# EAGLE design acoustic_1_0 (EAGLE 6.5.0)
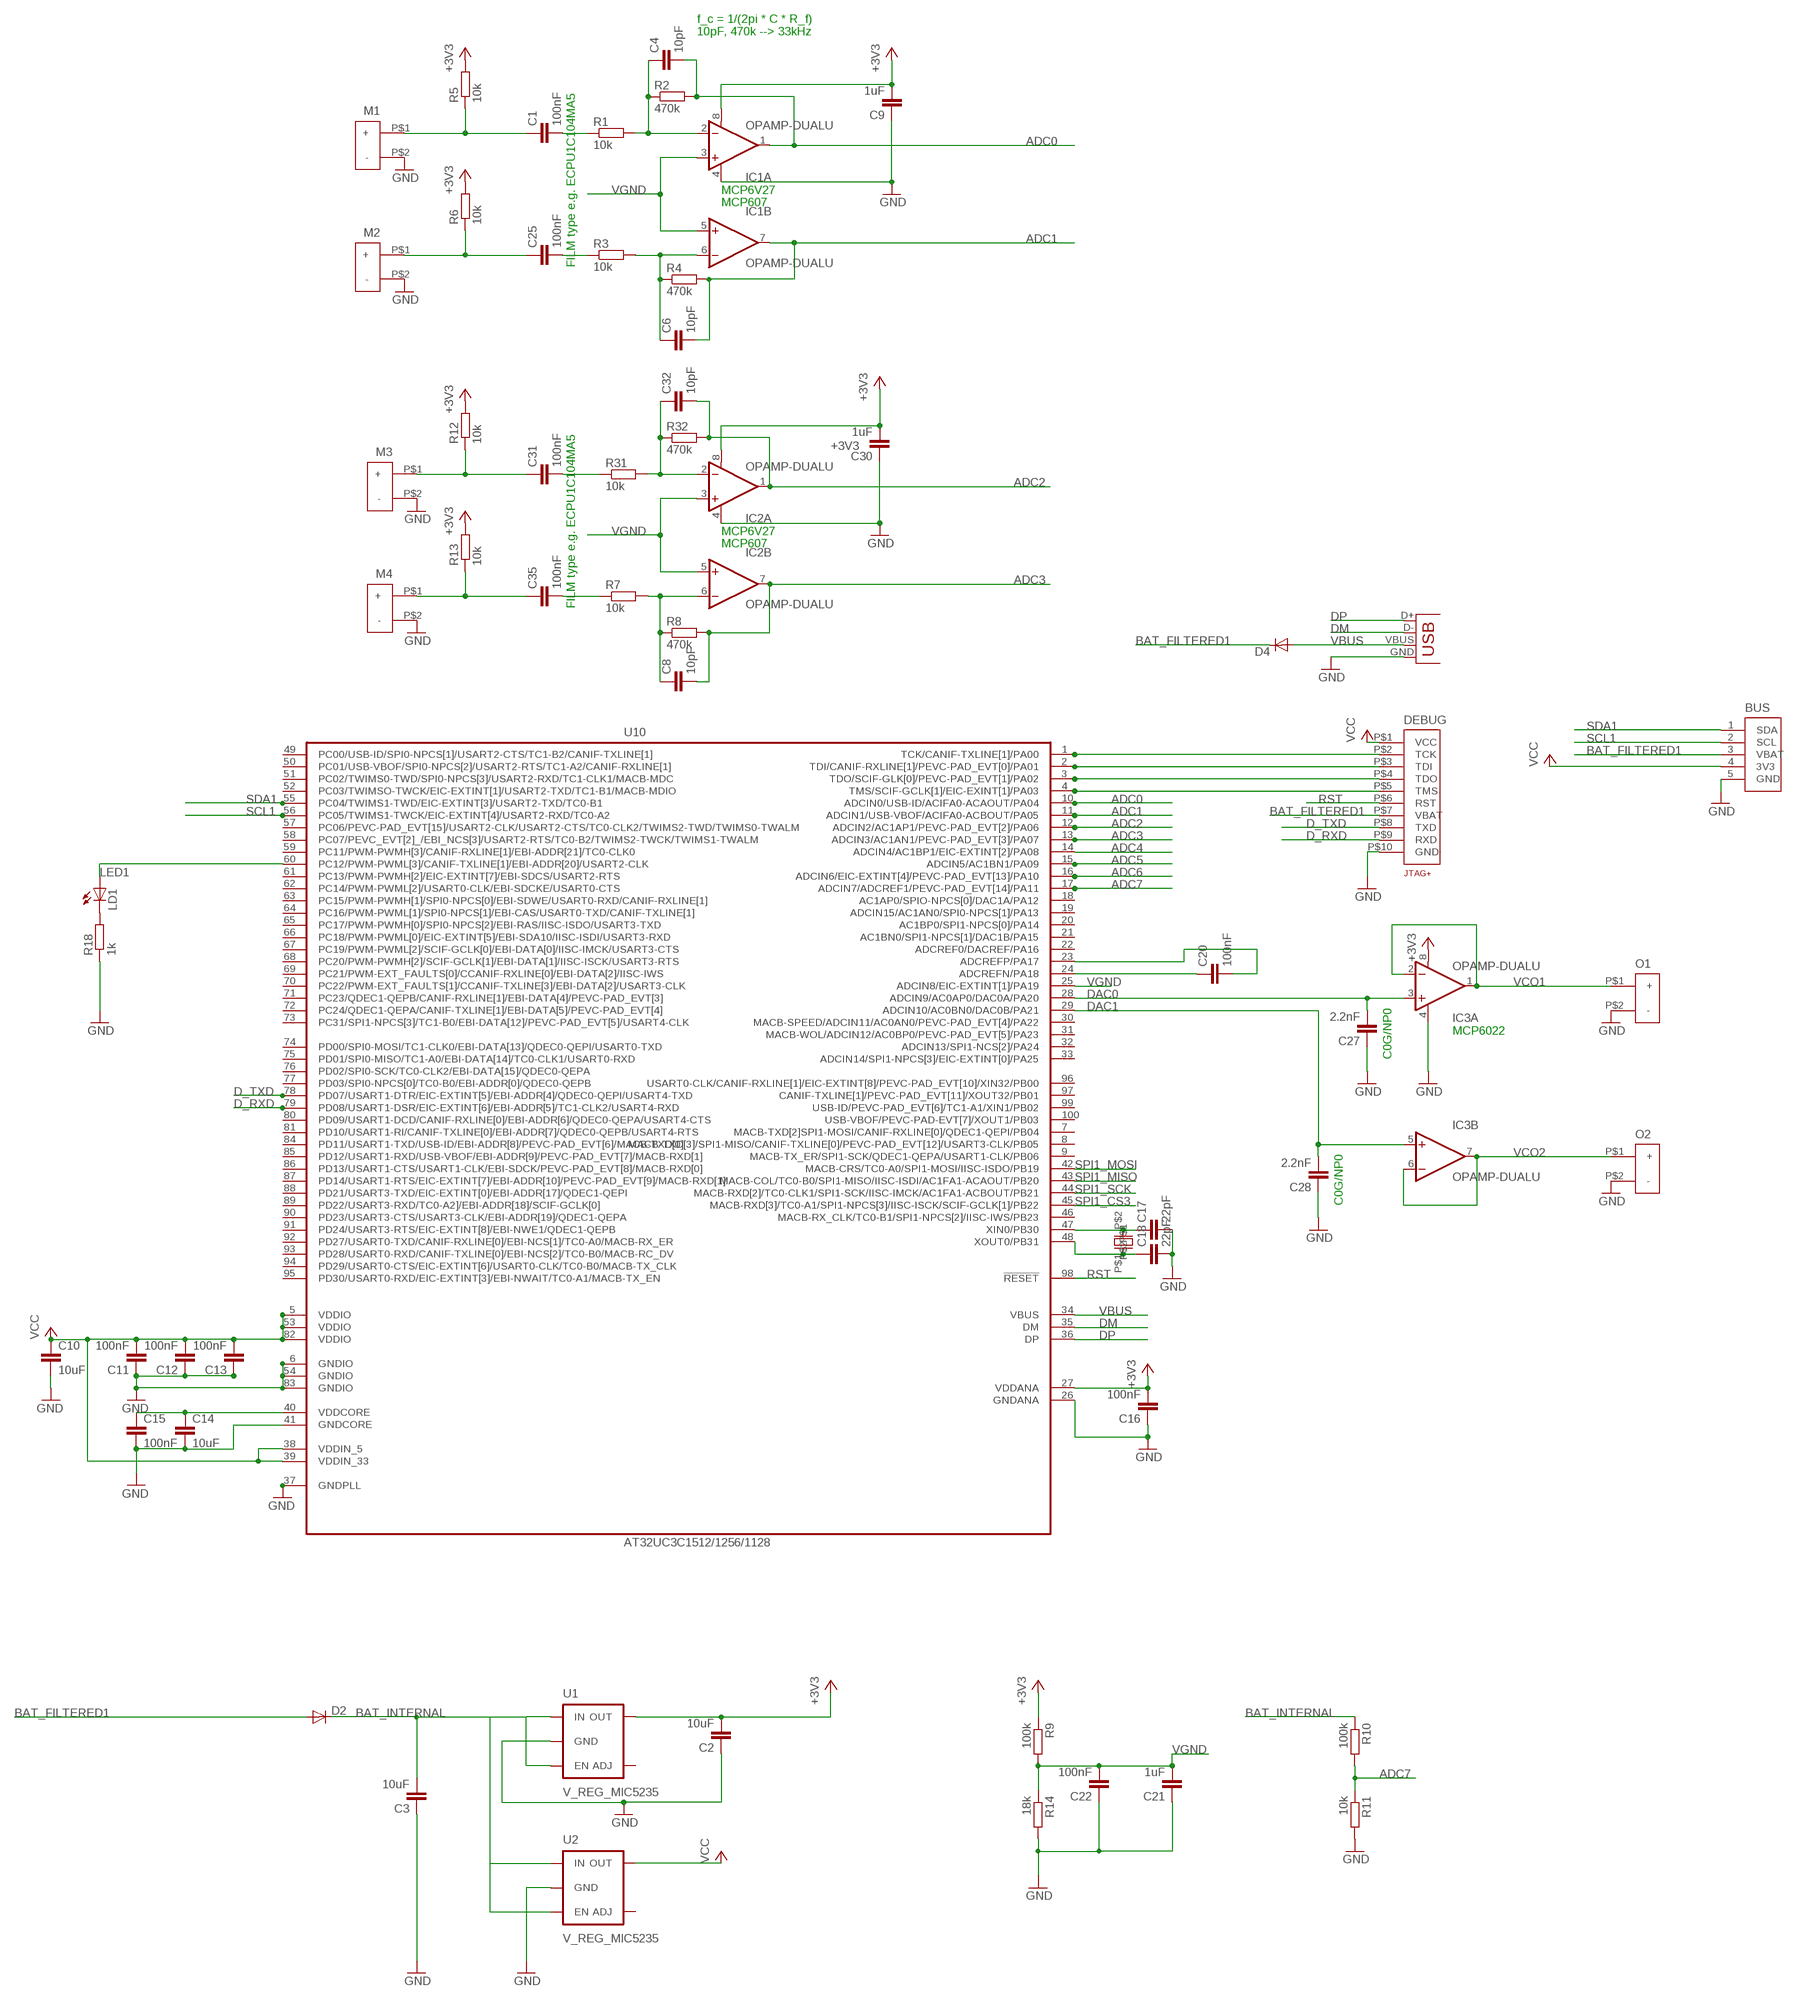
[diagram p0: schematic, sheet 1]

## Parts
BUS  I2C_BUS_PICOVERTICAL  [MOLEX_CONNECTOR_5_PINS_VERTICAL]
C1  100nF  C-EUC0805  [C0805]
C2  10uF  C-EUC0805  [C0805]
C3  10uF  C-EUC0805  [C0805]
C4  10pF  C-EUC0603  [C0603]
C6  10pF  C-EUC0603  [C0603]
C8  10pF  C-EUC0603  [C0603]
C9  1uF  C-EUC0805  [C0805]
C10  10uF  C-EUC0805  [C0805]
C11  100nF  C-EUC0603  [C0603]
C12  100nF  C-EUC0603  [C0603]
C13  100nF  C-EUC0603  [C0603]
C14  10uF  C-EUC0805  [C0805]
C15  100nF  C-EUC0603  [C0603]
C16  100nF  C-EUC0603  [C0603]
C17  22pF  C-EUC0402  [C0402]
C18  22pF  C-EUC0402  [C0402]
C20  100nF  C-EUC0603  [C0603]
C21  1uF  C-EUC0805  [C0805]
C22  100nF  C-EUC0603  [C0603]
C25  100nF  C-EUC0805  [C0805]
C27  2.2nF  C-EUC0805  [C0805]
C28  2.2nF  C-EUC0805  [C0805]
C30  1uF  C-EUC0805  [C0805]
C31  100nF  C-EUC0805  [C0805]
C32  10pF  C-EUC0603  [C0603]
C35  100nF  C-EUC0805  [C0805]
D2  DIODESOD  [SOD-323]
D4  DIODESOD  [SOD-323]
DEBUG  AVR32_JTAG+SERIALHIROSE_DF13  [MOLEX_CONNECTOR_10PINS]
IC1  OPAMP-DUALU  [SO08]
IC2  OPAMP-DUALU  [SO08]
IC3  OPAMP-DUALU  [SO08]
LD1  LEDCHIPLED_0805  [CHIPLED_0805]
M1  POWER  [POWER]
M2  POWER  [POWER]
M3  POWER  [POWER]
M4  POWER  [POWER]
O1  POWER  [POWER]
O2  POWER  [POWER]
R1  10k  R-EU_R0603  [R0603]
R2  470k  R-EU_R0603  [R0603]
R3  10k  R-EU_R0603  [R0603]
R4  470k  R-EU_R0603  [R0603]
R5  10k  R-EU_R0603  [R0603]
R6  10k  R-EU_R0603  [R0603]
R7  10k  R-EU_R0603  [R0603]
R8  470k  R-EU_R0603  [R0603]
R9  100k  R-EU_R0603  [R0603]
R10  100k  R-EU_R0603  [R0603]
R11  10k  R-EU_R0603  [R0603]
R12  10k  R-EU_R0603  [R0603]
R13  10k  R-EU_R0603  [R0603]
R14  18k  R-EU_R0603  [R0603]
R18  1k  R-EU_R0603  [R0603]
R31  10k  R-EU_R0603  [R0603]
R32  470k  R-EU_R0603  [R0603]
U1  V_REG_MIC5235  [SOT23-5]
U2  V_REG_MIC5235  [SOT23-5]
U10  AT32UC3C1512/1256/1128  [TQFP100]
U$8  CRYSTAL  [SMD_CRYSTAL_ABM]
X1  USB-MICROB  [USB-MICROB]

## Nets
+3V3 [power]: C2.2 C9.2 C16.2 C30.2 IC1.8(A:V+) IC2.8(A:V+) IC3.8(A:V+) R5.2 R6.2 R9.1 R12.2 R13.2 U1.5(OUT) U10.27(VDDANA)
ADC0: C4.2 IC1.1(A:OUT) R2.2 U10.10(ADCIN0/USB-ID/ACIFA0-ACAOUT/PA04)
ADC1: C6.2 IC1.7(B:OUT) R4.2 U10.11(ADCIN1/USB-VBOF/ACIFA0-ACBOUT/PA05)
ADC2: C32.2 IC2.1(A:OUT) R32.2 U10.12(ADCIN2/AC1AP1/PEVC-PAD_EVT[2]/PA06)
ADC3: C8.2 IC2.7(B:OUT) R8.2 U10.13(ADCIN3/AC1AN1/PEVC-PAD_EVT[3]/PA07)
ADC4: U10.14(ADCIN4/AC1BP1/EIC-EXTINT[2]/PA08)
ADC5: U10.15(ADCIN5/AC1BN1/PA09)
ADC6: U10.16(ADCIN6/EIC-EXTINT[4]/PEVC-PAD_EVT[13]/PA10)
ADC7: R10.2 R11.1 U10.17(ADCIN7/ADCREF1/PEVC-PAD_EVT[14]/PA11)
BAT_FILTERED1 [power]: BUS.3(VBAT) D2.2(A) D4.1(C) DEBUG.P$7(VBAT)
BAT_INTERNAL [power]: C3.2 D2.1(C) R10.1 U1.1(IN) U1.3(EN) U2.1(IN) U2.3(EN)
D_RXD: DEBUG.P$9(RXD) U10.79(PD08/USART1-DSR/EIC-EXTINT[6]/EBI-ADDR[5]/TC1-CLK2/USART4-RXD)
D_TXD: DEBUG.P$8(TXD) U10.78(PD07/USART1-DTR/EIC-EXTINT[5]/EBI-ADDR[4]/QDEC0-QEPI/USART4-TXD)
DAC0: C27.2 IC3.3(A:+IN) U10.28(ADCIN9/AC0AP0/DAC0A/PA20)
DAC1: C28.2 IC3.5(B:+IN) U10.29(ADCIN10/AC0BN0/DAC0B/PA21)
DM: U10.35(DM) X1.D-
DP: U10.36(DP) X1.D+
GND [power]: BUS.5(GND) C2.1 C3.1 C9.1 C10.2 C11.1 C12.1 C13.1 C14.2 C15.2 C16.1 C17.2 C18.2 C21.1 C22.1 C27.1 C28.1 C30.1 DEBUG.P$10(GND) IC1.4(A:V-) IC2.4(A:V-) IC3.4(A:V-) M1.P$2(-) M2.P$2(-) M3.P$2(-) M4.P$2(-) O1.P$2(-) O2.P$2(-) R11.2 R14.2 R18.1 U1.2(GND) U2.2(GND) U10.6(GNDIO) U10.26(GNDANA) U10.37(GNDPLL) U10.41(GNDCORE) U10.54(GNDIO) U10.83(GNDIO) X1.GND
LED1: LD1.A U10.60(PC12/PWM-PWML[3]/CANIF-TXLINE[1]/EBI-ADDR[20]/USART2-CLK)
N$1: DEBUG.P$5(TMS) U10.4(TMS/SCIF-GCLK[1]/EIC-EXINT[1]/PA03)
N$2: DEBUG.P$4(TDO) U10.3(TDO/SCIF-GLK[0]/PEVC-PAD_EVT[1]/PA02)
N$3: C18.1 U10.48(XOUT0/PB31) U$8.P$1
N$4: C17.1 U10.47(XIN0/PB30) U$8.P$2
N$5: LD1.C R18.2
N$6: C25.2 R3.1
N$7: C4.1 IC1.2(A:-IN) R1.2 R2.1
N$8: C20.2 U10.23(ADCREFP/PA17)
N$9: C6.1 IC1.6(B:-IN) R3.2 R4.1
N$10: C35.2 R7.1
N$11: C1.2 R1.1
N$12: C1.1 M1.P$1(+) R5.1
N$13: C25.1 M2.P$1(+) R6.1
N$14: C31.2 R31.1
N$17: DEBUG.P$3(TDI) U10.2(TDI/CANIF-RXLINE[1]/PEVC-PAD_EVT[0]/PA01)
N$19: C14.1 C15.1 U10.40(VDDCORE)
N$20: C32.1 IC2.2(A:-IN) R31.2 R32.1
N$21: C31.1 M3.P$1(+) R12.1
N$24: C35.1 M4.P$1(+) R13.1
N$26: C8.1 IC2.6(B:-IN) R7.2 R8.1
N$29: DEBUG.P$2(TCK) U10.1(TCK/CANIF-TXLINE[1]/PA00)
N$31: C20.1 U10.24(ADCREFN/PA18)
RST: DEBUG.P$6(RST) U10.98(!RESET)
SCL1: BUS.2(SCL) U10.56(PC05/TWIMS1-TWCK/EIC-EXTINT[4]/USART2-RXD/TC0-A2)
SDA1: BUS.1(SDA) U10.55(PC04/TWIMS1-TWD/EIC-EXTINT[3]/USART2-TXD/TC0-B1)
SPI1_CS3: U10.45(MACB-RXD[3]/TC0-A1/SPI1-NPCS[3]/IISC-ISCK/SCIF-GCLK[1]/PB22)
SPI1_MISO: U10.43(MACB-COL/TC0-B0/SPI1-MISO/IISC-ISDI/AC1FA1-ACAOUT/PB20)
SPI1_MOSI: U10.42(MACB-CRS/TC0-A0/SPI1-MOSI/IISC-ISDO/PB19)
SPI1_SCK: U10.44(MACB-RXD[2]/TC0-CLK1/SPI1-SCK/IISC-IMCK/AC1FA1-ACBOUT/PB21)
VBUS: D4.2(A) U10.34(VBUS) X1.VBUS
VCC [power]: BUS.4(3V3) C10.1 C11.2 C12.2 C13.2 DEBUG.P$1(VCC) U2.5(OUT) U10.5(VDDIO) U10.38(VDDIN_5) U10.39(VDDIN_33) U10.53(VDDIO) U10.82(VDDIO)
VCO1: IC3.1(A:OUT) IC3.2(A:-IN) O1.P$1(+)
VCO2: IC3.6(B:-IN) IC3.7(B:OUT) O2.P$1(+)
VGND: C21.2 C22.2 IC1.3(A:+IN) IC1.5(B:+IN) IC2.3(A:+IN) IC2.5(B:+IN) R9.2 R14.1 U10.25(ADCIN8/EIC-EXTINT[1]/PA19)
Unconnected: U1.4(ADJ) U2.4(ADJ) U10.7(MACB-TXD[2]SPI1-MOSI/CANIF-RXLINE[0]/QDEC1-QEPI/PB04) U10.8(MACB-TXD[3]/SPI1-MISO/CANIF-TXLINE[0]/PEVC-PAD_EVT[12]/USART3-CLK/PB05) U10.9(MACB-TX_ER/SPI1-SCK/QDEC1-QEPA/USART1-CLK/PB06) U10.18(AC1AP0/SPIO-NPCS[0]/DAC1A/PA12) U10.19(ADCIN15/AC1AN0/SPI0-NPCS[1]/PA13) U10.20(AC1BP0/SPI1-NPCS[0]/PA14) U10.21(AC1BN0/SPI1-NPCS[1]/DAC1B/PA15) U10.22(ADCREF0/DACREF/PA16) U10.30(MACB-SPEED/ADCIN11/AC0AN0/PEVC-PAD_EVT[4]/PA22) U10.31(MACB-WOL/ADCIN12/AC0BP0/PEVC-PAD_EVT[5]/PA23) U10.32(ADCIN13/SPI1-NCS[2]/PA24) U10.33(ADCIN14/SPI1-NPCS[3]/EIC-EXTINT[0]/PA25) U10.46(MACB-RX_CLK/TC0-B1/SPI1-NPCS[2]/IISC-IWS/PB23) U10.49(PC00/USB-ID/SPI0-NPCS[1]/USART2-CTS/TC1-B2/CANIF-TXLINE[1]) U10.50(PC01/USB-VBOF/SPI0-NPCS[2]/USART2-RTS/TC1-A2/CANIF-RXLINE[1]) U10.51(PC02/TWIMS0-TWD/SPI0-NPCS[3]/USART2-RXD/TC1-CLK1/MACB-MDC) U10.52(PC03/TWIMSO-TWCK/EIC-EXTINT[1]/USART2-TXD/TC1-B1/MACB-MDIO) U10.57(PC06/PEVC-PAD_EVT[15]/USART2-CLK/USART2-CTS/TC0-CLK2/TWIMS2-TWD/TWIMS0-TWALM) U10.58(PC07/PEVC_EVT[2]_/EBI_NCS[3]/USART2-RTS/TC0-B2/TWIMS2-TWCK/TWIMS1-TWALM) U10.59(PC11/PWM-PWMH[3]/CANIF-RXLINE[1]/EBI-ADDR[21]/TC0-CLK0) U10.61(PC13/PWM-PWMH[2]/EIC-EXTINT[7]/EBI-SDCS/USART2-RTS) U10.62(PC14/PWM-PWML[2]/USART0-CLK/EBI-SDCKE/USART0-CTS) U10.63(PC15/PWM-PWMH[1]/SPI0-NPCS[0]/EBI-SDWE/USART0-RXD/CANIF-RXLINE[1]) U10.64(PC16/PWM-PWML[1]/SPI0-NPCS[1]/EBI-CAS/USART0-TXD/CANIF-TXLINE[1]) U10.65(PC17/PWM-PWMH[0]/SPI0-NPCS[2]/EBI-RAS/IISC-ISDO/USART3-TXD) U10.66(PC18/PWM-PWML[0]/EIC-EXTINT[5]/EBI-SDA10/IISC-ISDI/USART3-RXD) U10.67(PC19/PWM-PWML[2]/SCIF-GCLK[0]/EBI-DATA[0]/IISC-IMCK/USART3-CTS) U10.68(PC20/PWM-PWMH[2]/SCIF-GCLK[1]/EBI-DATA[1]/IISC-ISCK/USART3-RTS) U10.69(PC21/PWM-EXT_FAULTS[0]/CCANIF-RXLINE[0]/EBI-DATA[2]/IISC-IWS) U10.70(PC22/PWM-EXT_FAULTS[1]/CCANIF-TXLINE[3]/EBI-DATA[2]/USART3-CLK) U10.71(PC23/QDEC1-QEPB/CANIF-RXLINE[1]/EBI-DATA[4]/PEVC-PAD_EVT[3]) U10.72(PC24/QDEC1-QEPA/CANIF-TXLINE[1]/EBI-DATA[5]/PEVC-PAD_EVT[4]) U10.73(PC31/SPI1-NPCS[3]/TC1-B0/EBI-DATA[12]/PEVC-PAD_EVT[5]/USART4-CLK) U10.74(PD00/SPI0-MOSI/TC1-CLK0/EBI-DATA[13]/QDEC0-QEPI/USART0-TXD) U10.75(PD01/SPI0-MISO/TC1-A0/EBI-DATA[14]/TC0-CLK1/USART0-RXD) U10.76(PD02/SPI0-SCK/TC0-CLK2/EBI-DATA[15]/QDEC0-QEPA) U10.77(PD03/SPI0-NPCS[0]/TC0-B0/EBI-ADDR[0]/QDEC0-QEPB) U10.80(PD09/USART1-DCD/CANIF-RXLINE[0]/EBI-ADDR[6]/QDEC0-QEPA/USART4-CTS) U10.81(PD10/USART1-RI/CANIF-TXLINE[0]/EBI-ADDR[7]/QDEC0-QEPB/USART4-RTS) U10.84(PD11/USART1-TXD/USB-ID/EBI-ADDR[8]/PEVC-PAD_EVT[6]/MACB-TXD[0]) U10.85(PD12/USART1-RXD/USB-VBOF/EBI-ADDR[9]/PEVC-PAD_EVT[7]/MACB-RXD[1]) U10.86(PD13/USART1-CTS/USART1-CLK/EBI-SDCK/PEVC-PAD_EVT[8]/MACB-RXD[0]) U10.87(PD14/USART1-RTS/EIC-EXTINT[7]/EBI-ADDR[10]/PEVC-PAD_EVT[9]/MACB-RXD[1]) U10.88(PD21/USART3-TXD/EIC-EXTINT[0]/EBI-ADDR[17]/QDEC1-QEPI) U10.89(PD22/USART3-RXD/TC0-A2]/EBI-ADDR[18]/SCIF-GCLK[0]) U10.90(PD23/USART3-CTS/USART3-CLK/EBI-ADDR[19]/QDEC1-QEPA) U10.91(PD24/USART3-RTS/EIC-EXTINT[8]/EBI-NWE1/QDEC1-QEPB) U10.92(PD27/USART0-TXD/CANIF-RXLINE[0]/EBI-NCS[1]/TC0-A0/MACB-RX_ER) U10.93(PD28/USART0-RXD/CANIF-TXLINE[0]/EBI-NCS[2]/TC0-B0/MACB-RC_DV) U10.94(PD29/USART0-CTS/EIC-EXTINT[6]/USART0-CLK/TC0-B0/MACB-TX_CLK) U10.95(PD30/USART0-RXD/EIC-EXTINT[3]/EBI-NWAIT/TC0-A1/MACB-TX_EN) U10.96(USART0-CLK/CANIF-RXLINE[1]/EIC-EXTINT[8]/PEVC-PAD_EVT[10]/XIN32/PB00) U10.97(CANIF-TXLINE[1]/PEVC-PAD_EVT[11]/XOUT32/PB01) U10.99(USB-ID/PEVC-PAD_EVT[6]/TC1-A1/XIN1/PB02) U10.100(USB-VBOF/PEVC-PAD-EVT[7]/XOUT1/PB03)

## Notes on the sheet
- f_c = 1/(2pi * C * R_f)
  10pF, 470k --> 33kHz
- MCP6V27
- MCP607
- FILM type e.g. ECPU1C104MA5
- MCP6V27
- MCP607
- FILM type e.g. ECPU1C104MA5
- MCP6022
- C0G/NP0
- C0G/NP0

## Library data of the parts
BUS = con-special_purpose:I2C_BUS_PICO; PLACE_PART: YES
C1-C4 C6 C8-C18 C20-C22 C25 C27 C28 C30-C32 C35 = rcl:C-EU: CAPACITOR, European symbol
D2 D4 = SparkFun:DIODE: Diode These are standard reverse protection diodes and small signal diodes. SMA package can handle up to about 1A. SOD-323 can handle about 200mA. What the SOD-323 package when ordering, there are some mfgs out there that are 5-pin packages.
DEBUG = con-special_purpose:AVR32_JTAG+SERIAL: Unified compact debug port with JTAG, 7-12V power supply (VBAT) and serial port.; DISTRIBUTOR: Digikey; ORDER_CODE: H3375-ND; PLACE_PART: YES
IC1-IC3 = SparkFun:OPAMP-DUAL: Operational Amplifier
LD1 = led:LED: LED OSRAM: - CHIPLED LG R971, LG N971, LY N971, LG Q971, LY Q971, LO R971, LY R971 LH N974, LH R974 LS Q976, LO Q976, LY Q976 LO Q996 - Hyper CHIPLED LW Q18S LB Q993, LB Q99A, LB R99A - SideLED LS A670, LO A670, LY A670, LG A670, LP A670 LB A673, LV A673, LT A673, LW A673 LH A674 LY A675 LS A676, LA A676, LO A676, LY A676, LW A676 LS A679, LY A679, LG A679 - Hyper Micro SIDELED® LS Y876, LA Y876, LO Y876, LY Y876 LT Y87S - SmartLED LW L88C, LW L88S LB L89C, LB L89S, LG L890 LS L89K, LO L89K, LY L89K LS L896, LA L896, LO L896, LY L896 - TOPLED LS T670, LO T670, LY T670, LG T670, LP T670 LSG T670, LSP T670, LSY T670, LOP T670, LYG T670 LG T671, LOG T671, LSG T671 LB T673, LV T673, LT T673, LW T673 LH T674 LS T676, LA T676, LO T676, LY T676, LB T676, LH T676, LSB T676, LW T676 LB T67C, LV T67C, LT T67C, LS T67K, LO T67K, LY T67K, LW E67C LS E67B, LA E67B, LO E67B, LY E67B, LB E67C, LV E67C, LT E67C LW T67C LS T679, LY T679, LG T679 LS T770, LO T770, LY T770, LG T770, LP T770 LB T773, LV T773, LT T773, LW T773 LH T774 LS E675, LA E675, LY E675, LS T675 LS T776, LA T776, LO T776, LY T776, LB T776 LHGB T686 LT T68C, LB T68C - Hyper Mini TOPLED® LB M676 - Mini TOPLED Santana® LG M470 LS M47K, LO M47K, LY M47K Source: http://www.osram.convergy.de LUXEON: - LUMILED® LXK2-PW12-R00, LXK2-PW12-S00, LXK2-PW14-U00, LXK2-PW14-V00 LXK2-PM12-R00, LXK2-PM12-S00, LXK2-PM14-U00 LXK2-PE12-Q00, LXK2-PE12-R00, LXK2-PE12-S00, LXK2-PE14-T00, LXK2-PE14-U00 LXK2-PB12-K00, LXK2-PB12-L00, LXK2-PB12-M00, LXK2-PB14-N00, LXK2-PB14-P00, LXK2-PB14-Q00 LXK2-PR12-L00, LXK2-PR12-M00, LXK2-PR14-Q00, LXK2-PR14-R00 LXK2-PD12-Q00, LXK2-PD12-R00, LXK2-PD12-S00 LXK2-PH12-R00, LXK2-PH12-S00 LXK2-PL12-P00, LXK2-PL12-Q00, LXK2-PL12-R00 Source: www.luxeon.com KINGBRIGHT: KA-3528ASYC Source: www.kingbright.com
M1-M4 O1 O2 = con-special_purpose:POWER; PLACE_PART: YES
R1-R14 R18 R31 R32 = rcl:R-EU_: RESISTOR, European symbol
U1 U2 = SparkFun:V_REG_MIC5235
U10 = atmel-avr32-michel:AT32UC3C1512/1256/1128: AT32UC3C1512/1256/1128; DISTRIBUTOR: Digikey; ORDER_CODE: AT32UC3C1512C-AUT-ND; PLACE_PART: YES; UNIT_PRICE: 17.65000; UNIT_PRICE_100X: 10.02880; UNIT_PRICE_10X: 17.65000; UNIT_PRICE_25X: 11.23240; UNIT_PRICE_50X: 11.23240
U$8 = Atmel_utils:CRYSTAL; DISTRIBUTOR: Digikey; ORDER_CODE: 535-9840-1-ND; PLACE_PART: YES
X1 = SparkFun:USB: USB Connectors USB-B-PTH is fully proven SKU : PRT-00139 USB-miniB is fully proven SKU : PRT-00587 USB-A-PCB is untested. USB-A-H is throughly reviewed, but untested. Spark Fun Electronics SKU : PRT-00437 USB-B-SMT is throughly reviewed, but untested. Needs silkscreen touching up. USB-A-S has not been used/tested USB-MB-H has not been used/tested

## Net classes
0 default: width 0.15 mm, drill 0.35 mm, clearance 0.15 mm
1 power: width 0.2 mm, drill 0.35 mm, clearance 0.15 mm
2 more_power: width 0.5 mm, drill 0.5 mm, clearance 0.15 mm

## Board
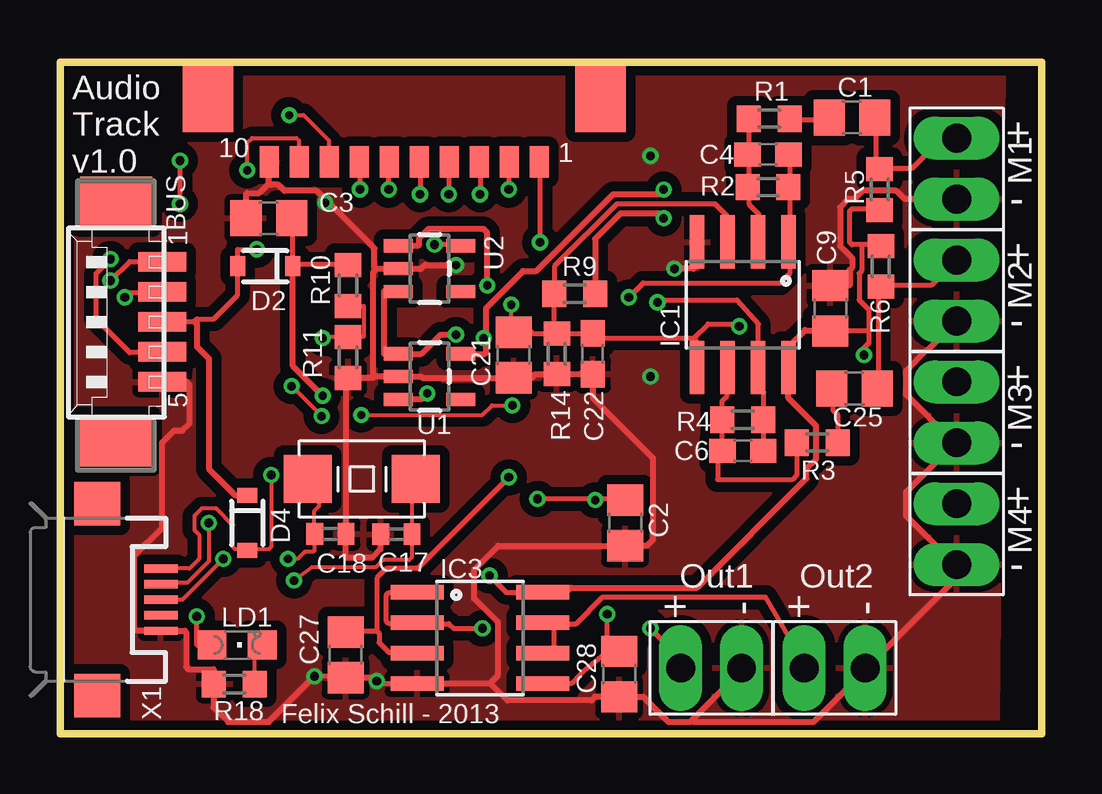
[diagram p1: board, top side]
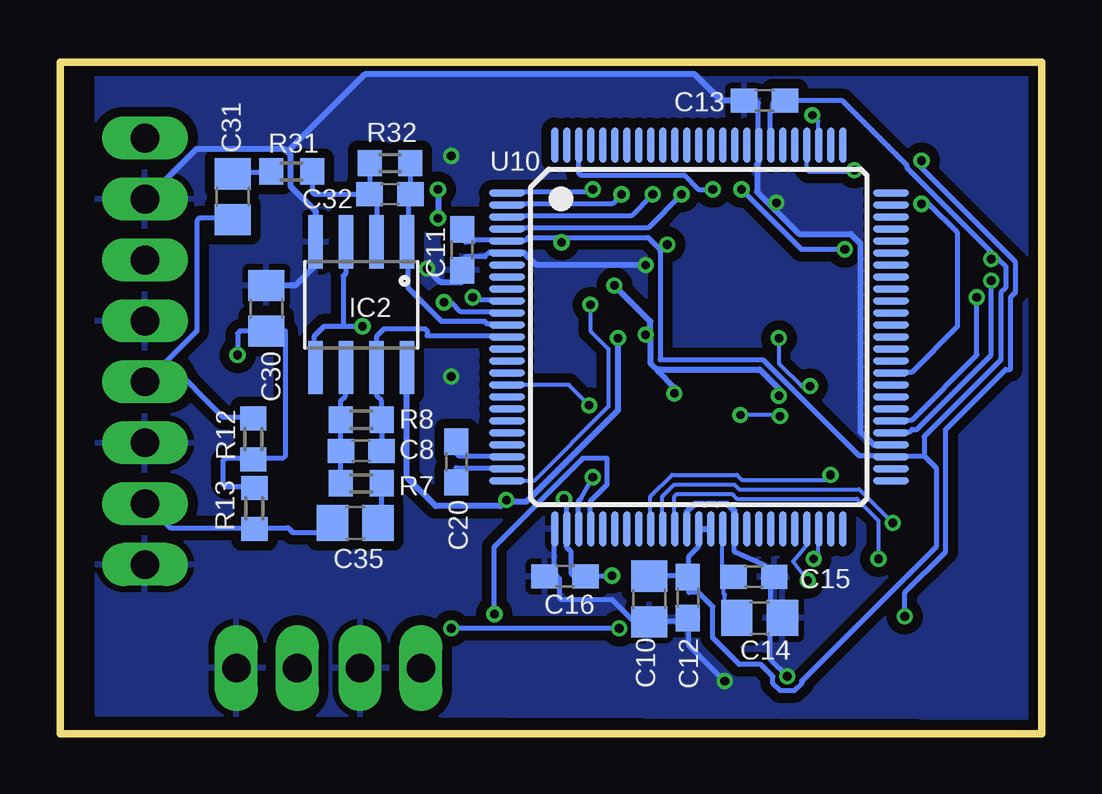
[diagram p2: board, bottom side, seen from below]

Size 40.9 x 28 mm. Coordinates in mm from the lower left corner, seen from the top.
Outline: 0,28 0,0 40.9,0 40.9,28 0,28
Copper layers (1*16): Top 0.035mm / dielectric 1mm / Bottom 0.035mm
Design rules "default": minimum track width 0.16mm, minimum drill 0.35mm, track to track 0.16mm, track to pad 0.16mm, pad to pad 0.16mm, via to via 0.16mm, smd to smd 0.15mm, copper to edge 0.2mm, drill to drill 0.2mm, minimum pad ring 0.2mm, minimum via ring 0.16mm, stop-mask expansion 4mil, vias tented up to drill 0.51mm, thermal gap 10mil

### Footprints (pad centres in the part's own frame; a part is rotated, then mirrored left to right if it is on the bottom)
MOLEX_CONNECTOR_5_PINS_VERTICAL = smd 0.8 x 2: 1 2.48,-2.57; 2 1.23,-2.57; 3 -0.02,-2.57; 4 -1.27,-2.57; 5 -2.52,-2.57 | smd 2.1 x 3: S1 4.98,-0.645; S2B -5,-0.645
C0805 = smd 1.3 x 1.5: 1 -0.95,0; 2 0.95,0
C0603 = smd 1.1 x 1: 1 -0.85,0; 2 0.85,0
C0402 = smd 0.7 x 0.9: 1 -0.65,0; 2 0.65,0
SOD-323 = smd 0.63 x 0.83: 1 -1.15,0; 2 1.15,0
MOLEX_CONNECTOR_10PINS = smd 0.8 x 1.3: P$1 -11.65,-0.65; P$2 -10.4,-0.65; P$3 -9.15,-0.65; P$4 -7.9,-0.65; P$5 -6.65,-0.65; P$6 -5.4,-0.65; P$7 -4.15,-0.65; P$8 -2.9,-0.65; P$9 -1.65,-0.65; P$10 -0.4,-0.65 | smd 2.1 x 3: P$11 -14.2,-3.4; P$12 2.15,-3.4
SO08 = smd 0.61 x 2.21: 1 -1.905,-2.616; 2 -0.635,-2.616; 3 0.635,-2.616; 4 1.905,-2.616; 5 1.905,2.616; 6 0.635,2.616; 7 -0.635,2.616; 8 -1.905,2.616
CHIPLED_0805 = smd 1.2 x 1.2: A 0,-1.05; C 0,1.05
POWER = drill 1.2 long: P$1 0,2.54; P$2 0,0
R0603 = smd 1 x 1.1: 1 -0.85,0; 2 0.85,0
SOT23-5 = smd 0.55 x 1.2: 1 -0.95,-1.3; 2 0,-1.3; 3 0.95,-1.3; 4 0.95,1.3; 5 -0.95,1.3
TQFP100 = smd 1.5 x 0.3: 1 -8,6; 2 -8,5.5; 3 -8,5; 4 -8,4.5; 5 -8,4; 6 -8,3.5; 7 -8,3; 8 -8,2.5; 9 -8,2; 10 -8,1.5; 11 -8,1; 12 -8,0.5; 13 -8,0; 14 -8,-0.5; 15 -8,-1; 16 -8,-1.5; 17 -8,-2; 18 -8,-2.5; 19 -8,-3; 20 -8,-3.5; 21 -8,-4; 22 -8,-4.5; 23 -8,-5; 24 -8,-5.5; 25 -8,-6; 51 8,-6; 52 8,-5.5; 53 8,-5; 54 8,-4.5; 55 8,-4; 56 8,-3.5; 57 8,-3; 58 8,-2.5; 59 8,-2; 60 8,-1.5; 61 8,-1; 62 8,-0.5; 63 8,0; 64 8,0.5; 65 8,1; 66 8,1.5; 67 8,2; 68 8,2.5; 69 8,3; 70 8,3.5; 71 8,4; 72 8,4.5; 73 8,5; 74 8,5.5; 75 8,6 | smd 0.3 x 1.5: 26 -6,-8; 27 -5.5,-8; 28 -5,-8; 29 -4.5,-8; 30 -4,-8; 31 -3.5,-8; 32 -3,-8; 33 -2.5,-8; 34 -2,-8; 35 -1.5,-8; 36 -1,-8; 37 -0.5,-8; 38 0,-8; 39 0.5,-8; 40 1,-8; 41 1.5,-8; 42 2,-8; 43 2.5,-8; 44 3,-8; 45 3.5,-8; 46 4,-8; 47 4.5,-8; 48 5,-8; 49 5.5,-8; 50 6,-8; 76 6,8; 77 5.5,8; 78 5,8; 79 4.5,8; 80 4,8; 81 3.5,8; 82 3,8; 83 2.5,8; 84 2,8; 85 1.5,8; 86 1,8; 87 0.5,8; 88 0,8; 89 -0.5,8; 90 -1,8; 91 -1.5,8; 92 -2,8; 93 -2.5,8; 94 -3,8; 95 -3.5,8; 96 -4,8; 97 -4.5,8; 98 -5,8; 99 -5.5,8; 100 -6,8
SMD_CRYSTAL_ABM = smd 2 x 2: P$1 -2.25,0; P$2 2.25,0
USB-MICROB = smd 0.35 x 1.4: D+ 0,2.65; D- -0.65,2.65; GND 1.3,2.65; ID 0.65,2.65; VBUS -1.3,2.65 | smd 1.8 x 1.9: MT1 -4,0; MT2 4,0

### Placement (x,y rotation side)
BUS  1.7,17.2 90 top
C1  33,25.7 180 top
C2  23.55,8.8 90 top
C3  8.7,21.5 0 top
C4  29.5,24.15 0 top
C6  28.45,11.8 0 top
C8  28.35,11.8 0 bottom
C9  32.1,17.75 270 top
C10  16.35,5.63 270 bottom
C11  24.14,20.19 90 bottom
C12  14.73,5.68 90 bottom
C13  11.55,26.4 0 bottom
C14  11.75,4.83 0 bottom
C15  11.99,6.54 0 bottom
C16  19.86,6.57 0 bottom
C17  14.01,8.33 180 top
C18  11.26,8.34 0 top
C20  24.38,11.33 90 bottom
C21  18.9,15.8 90 top
C22  22.2,15.85 90 top
C25  33.1,14.4 180 top
C27  11.9,3.3 90 top
C28  23.3,2.5 90 top
C30  32.3,17.75 270 bottom
C31  33.7,22.4 90 bottom
C32  27.15,22.5 0 bottom
C35  28.6,8.8 0 bottom
D2  8.55,19.5 180 top
D4  7.8,8.8 270 top
DEBUG  8.32,23.2 180 top
IC1  28.45,17.9 180 top
IC2  28.35,17.9 180 bottom
IC3  17.5,4 270 top
LD1  7.38,3.71 270 top
M1  37.36,22.3 0 top
M2  37.36,17.22 0 top
M3  37.36,12.14 0 top
M4  37.36,7.06 0 top
O1  28.4,2.75 90 top
O2  33.55,2.75 90 top
R1  29.55,25.65 180 top
R2  29.5,22.8 0 top
R3  31.55,12.15 180 top
R4  28.45,13.1 0 top
R5  34.15,22.7 270 top
R6  34.2,19.5 90 top
R7  28.35,10.45 180 bottom
R8  28.35,13.1 0 bottom
R9  21.45,18.35 180 top
R10  12,18.7 270 top
R11  12,15.7 270 top
R12  32.85,12.3 270 bottom
R13  32.8,9.4 90 bottom
R14  20.7,15.85 270 top
R18  7.26,2.08 0 top
R31  31.25,23.45 0 bottom
R32  27.15,23.8 0 bottom
U1  15.4,14.9 270 top
U2  15.4,19.4 270 top
U10  14.28,16.55 0 bottom
U$8  12.57,10.63 0 top
X1  1.55,5.6 270 top

### Tracks (layer width: path | path; a pad name or v marks a point on that pad's centre or on a via)
+3V3  (via drill 0.35, 0.36)
  Top 0.2: 33.4,20.4 34.2,20.4 R6.2 | 33.4,20.4 33,20.4 32.9,20.5 32.9,21.8 33,21.9 34.1,21.9 R5.2 | 33.7,16.8 33.7,17.7 33.3,18.1 33.3,19.2 33.4,19.3 33.4,20.4 | 33.7,16.8 33.7,16.3 33.4,16 33.4,15.9 v33.5,15.8 | 33.7,16.8 C9.2 | v17.9,6.6 18.6,5.9 20.1,5.9 IC3.8 | v19.9,9.8 22.3,9.8 23.5,9.8 C2.2
  Top 0.25: R9.1 22.3,20.65 23.35,21.7 24.95,21.7 v25.15,21.5 | v25.15,22.7 24.95,22.5 23.05,22.5 19.85,19.3 19.3,19.3 17.75,17.75 17.75,16.5 | 17.75,16.5 17.75,15.9 17.7,15.85 U1.5 | C9.2 31.1,16.8 31.05,16.85 30.35,16.15 30.35,15.3 IC1.8 30.35,15.2 30.35,14 31.5,12.85 31.5,11.45 31.1,11.05 31.1,10.65 26.55,6.1 21.3,6.1 21.1,5.9 20.2,5.9 IC3.8 | v22.3,9.75 22.3,9.8 | v17.65,16.5 17.75,16.5
  Bottom 0.2: R13.2 32.8,10.3 34,10.3 34.1,10.4 34.1,11.4 34,11.5 32.9,11.5 R12.2 32.8,11.5 31.6,11.5 31.5,11.6 31.5,16.8 C30.2 33.4,16.8 33.5,16.7 v33.5,15.8 | v17.9,6.6 19,6.6 C16.2 19.1,6.6 19.5,6.6 19.6,6.7 19.6,7.6 19.8,7.8 19.8,8.5 U10.27 19.8,8.6 19.8,9.7 v19.9,9.8
  Bottom 0.25: v25.15,22.7 v25.15,21.5 | IC2.8 26.45,15.25 26.45,10.7 25.25,9.5 22.55,9.5 v22.3,9.75 22.2,9.7 21.45,9.7 17.65,13.5 v17.65,16.5
ADC0  (via drill 0.36)
  Top 0.2: 30.4,22.8 30.4,24.1 C4.2 | 30.4,22.8 30.4,20.6 IC1.1 30.4,20.5 30.4,19.2 30,18.8 24.3,18.8 v23.7,18.2 | 30.4,22.8 R2.2
  Bottom 0.2: v23.7,18.2 23.6,18.1 22.3,18.1 U10.10
ADC1  (via drill 0.36)
  Top 0.2: C6.2 R4.2 29.3,14.3 29.1,14.5 29.1,15.2 IC1.7 29.1,15.3 29.1,17.1 28.2,18.1 24.9,18.1 v24.9,18
  Bottom 0.2: v24.9,18 24.6,18 24.2,17.6 22.3,17.6 U10.11
ADC2
  Bottom 0.2: U10.12 22.3,17.1 23.1,17.1 23.2,17.2 25,17.2 26.4,18.6 26.4,20.5 IC2.1 26.4,20.6 26.4,22.3 26.2,22.5 26.3,22.6 | R32.2 26.3,22.6 | 26.3,22.6 C32.2
ADC3
  Bottom 0.2: C8.2 R8.2 27.5,13.9 27.7,14.1 27.7,15.2 IC2.7 27.7,15.3 27.7,16.6 27.4,16.9 25.7,16.9 25.6,16.8 25.6,16.6 22.3,16.6 U10.13
ADC7  (via drill 0.35)
  Top 0.16: R10.2 12.65,17.85 12.65,16.55 R11.1 11,16.55 v10.95,16.5 | v18.85,13.7 18,13.7 17.6,13.3 v12.55,13.3 | v9.65,14.5 v10.9,13.25
  Bottom 0.16: U10.17 19.7,14.55 v18.85,13.7 | v12.55,13.3 10.95,13.3 v10.9,13.25 | v9.65,14.5 10,14.5 10.95,15.45 v10.95,16.5
BAT_FILTERED1  (via drill 0.36)
  Top 0.2: v12.5,22.7 12.5,23.8 DEBUG.P$7 | v8.2,20.2 7.4,20.2 D2.2 7.4,18.3 6.4,17.3 5.7,17.3 5.6,17.2 4.3,17.2 BUS.3
  Top 0.25: D4.1 7.3,9.95 6.2,11.05 6.2,15.65 5.7,16.15 5.7,17.1 5.6,17.2
  Bottom 0.2: v12.5,22.7 10,20.2 v8.2,20.2
BAT_INTERNAL  (via drill 0.35)
  Top 0.2: 9.7,19.6 12,19.6 R10.1 | 9.7,19.6 9.7,21.5 C3.2 | 9.7,19.6 D2.1
  Top 0.25: U1.3 15.05,13.95 v15.3,14.2 | v16.5,16.65 15.85,16.65 15.05,15.85 U1.1 13.5,15.85 13.5,18.45 U2.3 | U2.1 14.9,20.35 14.95,20.4 14.95,20.65 15.35,21.05 17.65,21.05 17.8,20.9 v17.8,18.7 | D2.1 9.7,15.35 v10.95,14.1
  Bottom 0.25: v15.3,14.2 15.3,14.45 15.98,15.12 | 15.98,15.12 16.3,15.45 16.3,16.45 v16.5,16.65 16.3,16.6 16.3,17.2 v17.8,18.7 | v10.95,14.1 10.95,14.4 11.75,15.2 15.9,15.2 15.98,15.12
D_RXD  (via drill 0.35)
  Top 0.16: v7.8,23.5 7.8,24.65 8,24.85 9.85,24.85 9.95,24.75 9.95,23.85 DEBUG.P$9
  Bottom 0.16: v7.8,23.5 7.85,23.45 9.7,23.45 9.8,23.55 9.8,24.55 U10.79
D_TXD  (via drill 0.35)
  Top 0.16: v9.55,25.8 10.15,25.8 11.2,24.75 11.2,23.85 DEBUG.P$8
  Bottom 0.16: v9.55,25.8 9.3,25.55 9.3,24.55 U10.78
DAC0  (via drill 0.36)
  Top 0.2: 13.2,4.3 13.3,4.2 13.3,3.8 13.7,3.4 14.8,3.4 IC3.3 | 13.2,4.3 11.9,4.3 C27.2 | 13.2,4.3 13.2,6.5 13.6,6.9 14.9,6.9 v18.7,10.7
  Bottom 0.2: v18.7,10.7 19.2,9.8 19.3,9.7 19.3,8.6 U10.28
DAC1  (via drill 0.36)
  Top 0.2: IC3.5 20.2,2.1 21.3,2.1 21.7,2.5 22.9,3.5 C28.2 22.7,3.4 22.7,3.5 22.8,3.6 v22.8,5
  Bottom 0.2: v22.8,5 22.8,7.8 19.1,11.5 18.1,11.5 18.1,10.4 18.8,9.7 18.8,8.6 U10.29
DM  (via drill 0.36)
  Top 0.16: v6.2,8.8 6.2,7.2 5.3,6.3 4.2,6.3 X1.D-
  Bottom 0.16: v6.2,8.8 7.6,10.2 12.6,10.2 12.8,10.4 15.3,10.4 15.8,9.9 15.8,8.6 U10.35
DP  (via drill 0.36)
  Top 0.16: X1.D+ 5.1,5.6 v6.8,7.3
  Bottom 0.16: v6.8,7.3 6.8,8.9 7.7,9.8 12.7,9.8 12.9,10 15.2,10 15.3,9.9 15.3,8.6 U10.36
GND  (via drill 0.35, 0.36)
  Top 0.2: v13.2,2.2 13.4,2.2 13.5,2.1 14.8,2.1 IC3.4 | v10.6,2.4 11.9,2.4 C27.1
  Top 0.25: C9.1 32.9,18.7 32.9,19.35 33,19.45 33,19.85 32.5,20.35 32.5,21.95 32.85,22.3 33.1,22.3 33.45,22.65 34.85,22.65 35.2,22.3 M1.P$2 | v25.6,19.4 26.4,19.4 26.55,19.55 26.55,20.5 IC1.4 | 8.7,22.95 8.7,23.85 DEBUG.P$10 | 8.7,22.95 8.3,22.55 7.8,22.55 7.75,22.5 C3.1 | C17.2 13.35,8.3 13.35,7.7 13,7.35 11.95,7.35 11.9,7.4 11.9,8.3 C18.2 11.9,8.45 11.9,14.8 R11.2 13.05,14.85 13.1,14.9 | 13.1,14.9 U1.2 15.05,14.9 15.1,14.85 C21.1 19.65,14.85 19.8,15 R14.2 21.7,15 22.15,15.45 22.2,15.45 C22.1 22.2,14 24.7,11.5 24.7,8.1 24.45,7.85 C2.1 18.25,7.85 17.25,6.85 17.25,5.65 18.25,4.65 18.25,2.45 18,2.2 17.95,2.1 | 13.2,19.4 U2.2 15.05,19.4 15.2,19.55 v16.5,19.55 | 13.2,19.4 13.05,19.25 13.05,15 13.1,14.9 | 11.12,22.23 13.1,20.25 13.1,19.45 13.2,19.4 | 11.12,22.23 10.7,22.65 9.35,22.65 9.1,22.9 8.8,22.9 8.7,22.95 | C27.1 13.05,2.35 v13.2,2.2 | BUS.5 4.3,14.7 5.25,14.7 5.4,14.55 5.4,12.95 5.1,12.65 4.75,12.65 4.25,12.15 4.25,8.6 3.1,7.45 3.1,4.4 3.2,4.3 X1.GND 5.2,4.3 5.25,4.25 5.25,2.8 5.35,2.7 6.4,2.7 6.4,2.1 R18.1 6.4,2 6.4,1.1 7,0.5 8.7,0.5 v10.6,2.4 | O1.P$2 28.4,2.65 26.33,0.58 | 26.33,0.58 26.25,0.5 25.35,0.5 24.3,1.55 C28.1 22.3,1.55 22.15,1.4 18.65,1.4 17.95,2.1 | 26.33,0.58 26.4,0.5 31.4,0.5 33.55,2.65 O2.P$2 33.65,2.8 37.4,6.55 37.4,7.05 M4.P$2 37.25,7.1 35.25,9.1 35.25,10.1 37.25,12.1 37.35,12.1 M3.P$2 37.2,12.2 35.25,14.15 35.25,15.15 36.1,16 36.15,16 37.35,17.2 M2.P$2 | 17.95,2.1 14.95,2.1 IC3.4 | v11.05,22.15 11.12,22.23
  Bottom 0.2: C13.1 12.3,26.4 11.9,26.4 11.8,26.3 11.8,24.6 U10.83 | C11.1 24.1,19.4 24.1,19.8 24,19.9 23.2,19.9 23,20.1 22.3,20.1 U10.6 | 14.7,4.7 16.3,4.7 C10.2 16.4,4.7 17,4.7 17.9,5.6 20,5.6 20.1,5.7 20.1,6.5 20.2,6.6 20.3,6.6 | 14.7,4.7 14.7,4.8 C12.1 14.7,4.7 | 14.7,4.7 14.7,3.7 v13.2,2.2 | 11.5,6.5 11.3,6.5 11.3,4.9 C14.2 11.3,4.8 11.3,3.1 v10.6,2.4 | 11.5,6.5 C15.2 11.6,6.5 11.5,6.5 | 11.5,6.5 11.5,7 12.8,7.6 12.8,8.5 U10.41 | 20.3,6.6 20.7,6.6 C16.1 20.3,6.6 | 20.3,6.6 20.3,8.5 U10.26
  Bottom 0.25: C30.1 31.1,18.7 30.25,19.55 30.25,20.5 IC2.4 30.25,20.6 30.25,21.8 31.3,22.85 31.3,24.15 31.42,24.27 | 31.42,24.27 31.55,24.4 35.2,24.4 37.3,22.3 M1.P$2 | U10.54 7,12.05 7.55,12.6 7.55,20.45 7.95,20.85 10.1,20.85 11.23,21.98 | 11.23,21.98 11.85,22.6 11.85,23.75 11.8,23.8 11.8,24.45 U10.83 | 31.42,24.27 28.2,27.5 14.45,27.5 13.35,26.4 12.45,26.4 C13.1 | v25.6,19.4 25.05,18.85 24.15,18.85 24.15,19.25 C11.1 | U10.6 21.55,20.05 21.05,19.55 v16.5,19.55 | U10.37 14.8,8.55 14.8,9.25 14.45,9.6 14.1,9.6 14.05,9.55 14,9.55 13.95,9.6 13.6,9.6 13.55,9.55 13.5,9.55 13.45,9.6 13.1,9.6 12.8,9.3 12.8,8.65 U10.41 | v11.05,22.15 11.23,21.98
  other vias: 24.6,14.9 24.6,24.1
  pour Bottom (isolate 0.406): 37.4,27.6 -0.3,27.65 -0.6,0.65 39.4,0.8 39.4,27.6
  pour Top (isolate 0.406): 0.55,27.75 0.2,27.45 0.2,0.65 1.4,0.35 37.5,0.6 39.1,0.6 39.35,27.65 2,27.7
LED1  (via drill 0.36)
  Top 0.2: v5.7,4.9 5.7,3.7 6.3,3.7 LD1.A | v5,22.1 v5,23.9
  Bottom 0.2: v5.7,4.9 5.7,5.9 4,7.6 4,12.7 1.5,15.2 1.3,15.2 1.3,18.2 1.1,18.4 1.1,19.7 5.2,23.8 5.2,23.9 v5,23.9 | U10.60 6.2,15.1 5.4,15.1 3.5,17 3.5,20.9 4.7,22.1 v5,22.1
N$1  (via drill 0.36)
  Top 0.2: v15,22.5 15,23.8 DEBUG.P$5
  Bottom 0.2: v15,22.5 16.4,21.1 22.2,21.1 U10.4
N$2  (via drill 0.36)
  Top 0.2: v16.2,22.5 16.2,23.8 DEBUG.P$4
  Bottom 0.2: v16.2,22.5 17.1,21.6 22.2,21.6 U10.3
N$3  (via drill 0.35)
  Top 0.16: U$8.P$1 10.35,10.65 10.8,10.65 10.8,9.5 10.6,9.3 C18.1 10.6,8.3 10.6,7.65 10.55,7.6 10.2,7.6 9.9,7.3 v9.5,7.3
  Bottom 0.16: v9.5,7.3 9.3,7.5 9.3,8.55 U10.48
N$4  (via drill 0.35)
  Top 0.16: U$8.P$2 14.8,10.65 14.65,10.65 14.65,8.35 C17.1 14.65,8.25 14.65,7.35 14.55,7.25 13.45,7.25 13.15,6.95 10.5,6.95 v9.75,6.4
  Bottom 0.16: v9.75,6.4 10.35,7.2 9.8,7.85 9.8,8.55 U10.47
N$5
  Top 0.16: R18.2 8.1,2.1 8.1,3.65 8.15,3.7 8.4,3.7 LD1.C
N$6
  Top 0.2: R3.1 32.4,13.3 32.2,13.5 32.2,14.4 C25.2
N$7
  Top 0.2: R1.2 28.7,24.2 C4.1 28.7,24.1 28.7,22.8 | 28.7,22.8 28.7,22.1 29.1,21.7 29.1,20.6 IC1.2 | 28.7,22.8 R2.1
N$8
  Bottom 0.2: U10.23 22.3,11.6 24.3,11.6 24.4,11.7 24.4,12.1 C20.2
N$9
  Top 0.2: R3.2 30.7,10.8 30.5,10.6 27.4,10.6 27.4,11.8 C6.1 R4.1 27.6,13.9 27.8,14.1 27.8,15.2 IC1.6
N$10
  Bottom 0.2: R7.1 27.5,9.3 27.7,9.1 27.7,8.8 C35.2
N$11
  Top 0.2: C1.2 32.1,25.7 32.1,25.6 30.4,25.6 R1.1
N$12
  Top 0.2: M1.P$1 37.3,24.8 36.7,24.8 35.5,23.6 34.2,23.6 R5.1 34.1,23.5 34,23.6 34,25.7 C1.1
N$13
  Top 0.2: 34.2,18.7 36.3,18.7 M2.P$1 | 34.2,18.7 34.1,18.7 34.1,14.4 C25.1 | 34.2,18.7 R6.1
N$14
  Bottom 0.2: C31.2 33.7,23.4 32.1,23.4 R31.1
N$17  (via drill 0.36)
  Top 0.2: v17.5,22.5 17.5,23.8 DEBUG.P$3
  Bottom 0.2: v17.5,22.5 17.9,22.1 22.2,22.1 U10.2
N$19
  Bottom 0.16: C14.1 13.2,4.85 13.2,5.8 13.25,5.85 13.25,6.5 C15.1 13.3,6.6 13.3,8.55 U10.40
N$20
  Bottom 0.2: R32.1 C32.1 | C32.1 27.7,22.5 27.7,20.6 IC2.2 | C32.1 30.3,22.5 30.4,22.6 R31.2
N$21
  Bottom 0.2: C31.1 33.7,21.5 35.1,21.5 35.2,21.4 35.2,16.8 37.3,14.7 M3.P$1 36.4,15.5 34.1,13.2 32.9,13.2 R12.1
N$24
  Bottom 0.2: 32.8,8.6 36.3,8.6 37.3,9.6 M4.P$1 | 32.8,8.6 31.4,8.6 31.2,8.4 29.6,8.4 29.6,8.8 C35.1 | 32.8,8.6 R13.1
N$26
  Bottom 0.2: R7.2 29.2,11.7 | 29.2,11.7 29.1,11.8 29.2,11.9 R8.1 29.2,13.9 29,14.1 29,15.2 IC2.6 | 29.2,11.7 C8.1
N$29  (via drill 0.36)
  Top 0.2: v18.7,22.7 18.7,23.8 DEBUG.P$2
  Bottom 0.2: v18.7,22.7 18.8,22.6 22.2,22.6 U10.1
N$31
  Bottom 0.2: U10.24 22.3,11.1 24.4,11.1 24.4,10.5 C20.1
RST  (via drill 0.36)
  Top 0.2: v13.7,22.7 13.7,23.8 DEBUG.P$6
  Bottom 0.2: v13.7,22.7 14.3,22.7 14.9,23.3 19.2,23.3 19.3,23.4 19.3,24.5 U10.98
SCL1  (via drill 0.36)
  Top 0.2: v2.7,18.2 2.9,18.4 4.24,18.4 BUS.2
  Bottom 0.2: v2.7,18.2 2.7,15.8 5.4,13.1 6.2,13.1 U10.56
SDA1  (via drill 0.36)
  Top 0.2: v2.1,18.9 2.9,19.7 4.2,19.7 BUS.1
  Bottom 0.2: v2.1,18.9 2.1,15.8 5.2,12.7 5.4,12.7 5.5,12.6 6.2,12.6 U10.55
VBUS  (via drill 0.36)
  Top 0.16: X1.VBUS 5.4,6.9 5.8,7.3 5.8,8.3 5.6,8.5 5.6,9.1 5.9,9.4 6.5,9.4 7.2,8.7 7.2,7.8 7.3,7.7 7.8,7.7 | 7.8,7.7 8.7,7.7 8.8,7.8 v8.8,10.8 | 7.8,7.7 D4.2
  Bottom 0.16: v8.8,10.8 9,10.6 12.5,10.6 12.7,10.8 15.4,10.8 16.3,9.9 16.3,8.6 U10.34
VCC  (via drill 0.36)
  Top 0.2: v20,20.5 20,23.8 DEBUG.P$1 | v15.6,20.4 16.7,20.4 U2.5 | v2.1,19.8 1.5,19.2 1.5,17.3 2.9,15.9 4.2,15.9 BUS.4
  Bottom 0.2: U10.82 11.3,24.6 11.3,25.9 11.2,26 11.2,26.3 11.1,26.4 C13.2 10.6,26.4 8.3,26.4 5.6,23.7 5.6,23.6 1.8,19.8 | C11.2 24.1,21 24.1,20.6 24,20.5 23.7,20.5 23.6,20.6 22.3,20.6 U10.5 22.2,20.6 21.5,20.6 21.4,20.7 20.2,20.7 v20,20.5 20.1,20.7 16.4,20.7 15.85,20.15 | U10.38 14.3,8.5 14.3,7.8 14.7,7.4 14.7,6.6 C12.2 | C10.1 16.3,6.6 14.8,6.6 C12.2 | v15.6,20.4 15.85,20.15 | 15.85,20.15 15.9,20.1 15.9,15.6 11.6,15.6 7.6,11.6 6.3,11.6 U10.53 6.2,11.6 4.9,11.6 | 4.9,11.6 4.4,11.1 4.4,7.8 10,2.2 10,2.1 10.3,1.8 10.9,1.8 11.2,2.1 11.2,2.4 11.7,2.9 12.6,2.9 13.7,4 13.7,5.3 14.3,5.9 14.7,5.9 14.7,6.5 C12.2 | 4.9,11.6 4.9,12.4 1.7,15.6 1.7,18.4 1.5,18.6 1.5,19.5 1.8,19.8 | 1.8,19.8 v2.1,19.8
  Bottom 0.25: U10.38 U10.39
VCO1  (via drill 0.36)
  Top 0.2: v24.6,4.4 25.8,3.2 25.8,2.8 O1.P$1 | v17.6,4.4 16.4,4.4 16.2,4.6 14.9,4.6 IC3.2 14.8,4.6 13.7,4.6 13.6,4.7 13.6,5.8 13.7,5.9 14.8,5.9 IC3.1
  Bottom 0.2: v17.6,4.4 v24.6,4.4
VCO2
  Top 0.2: 20.6,4.6 20.6,3.4 20.2,3.4 IC3.6 | 20.6,4.6 20.2,4.6 IC3.7 20.6,4.6 | 20.6,4.6 21.5,4.6 22.6,5.7 29.4,5.7 31.1,2.8 O2.P$1
VGND  (via drill 0.35, 0.36)
  Top 0.16: v18.8,17.9 18.8,16.75 18.85,16.7 C21.2
  Top 0.2: 20.6,16.7 19.7,16.7 19.6,16.8 18.9,16.8 C21.2 | 20.6,16.7 R9.2 20.6,19.5 23.2,22.1 27.3,22.1 27.8,21.6 27.8,20.6 IC1.3 | 20.6,16.7 R14.1 C22.2 22.2,16.5 26.4,16.5 | 26.4,16.5 26.5,16.4 26.5,15.3 IC1.5 | 26.4,16.5 27,17.1 28.3,17.1 v28.3,17
  Bottom 0.16: U10.25 21.15,10.55 18.05,13.65 18.05,16.05 18.8,16.8 v18.8,17.9
  Bottom 0.2: 29.1,17 29.9,17 30.3,16.6 30.3,15.3 IC2.5 | 29.1,17 v28.3,17 | 29.1,17 29.1,19.1 29,19.2 29,20.5 IC2.3

### Text on the board
tPlace: 10 | 1 | M1 | 1 | M2 | 5 | M3 | M4 | Out1 | Out2
tNames: Audio / Track / v1.0 | Felix Schill - 2013